# EAGLE design MOSFET_Power_Switch (EAGLE 9.6.2)
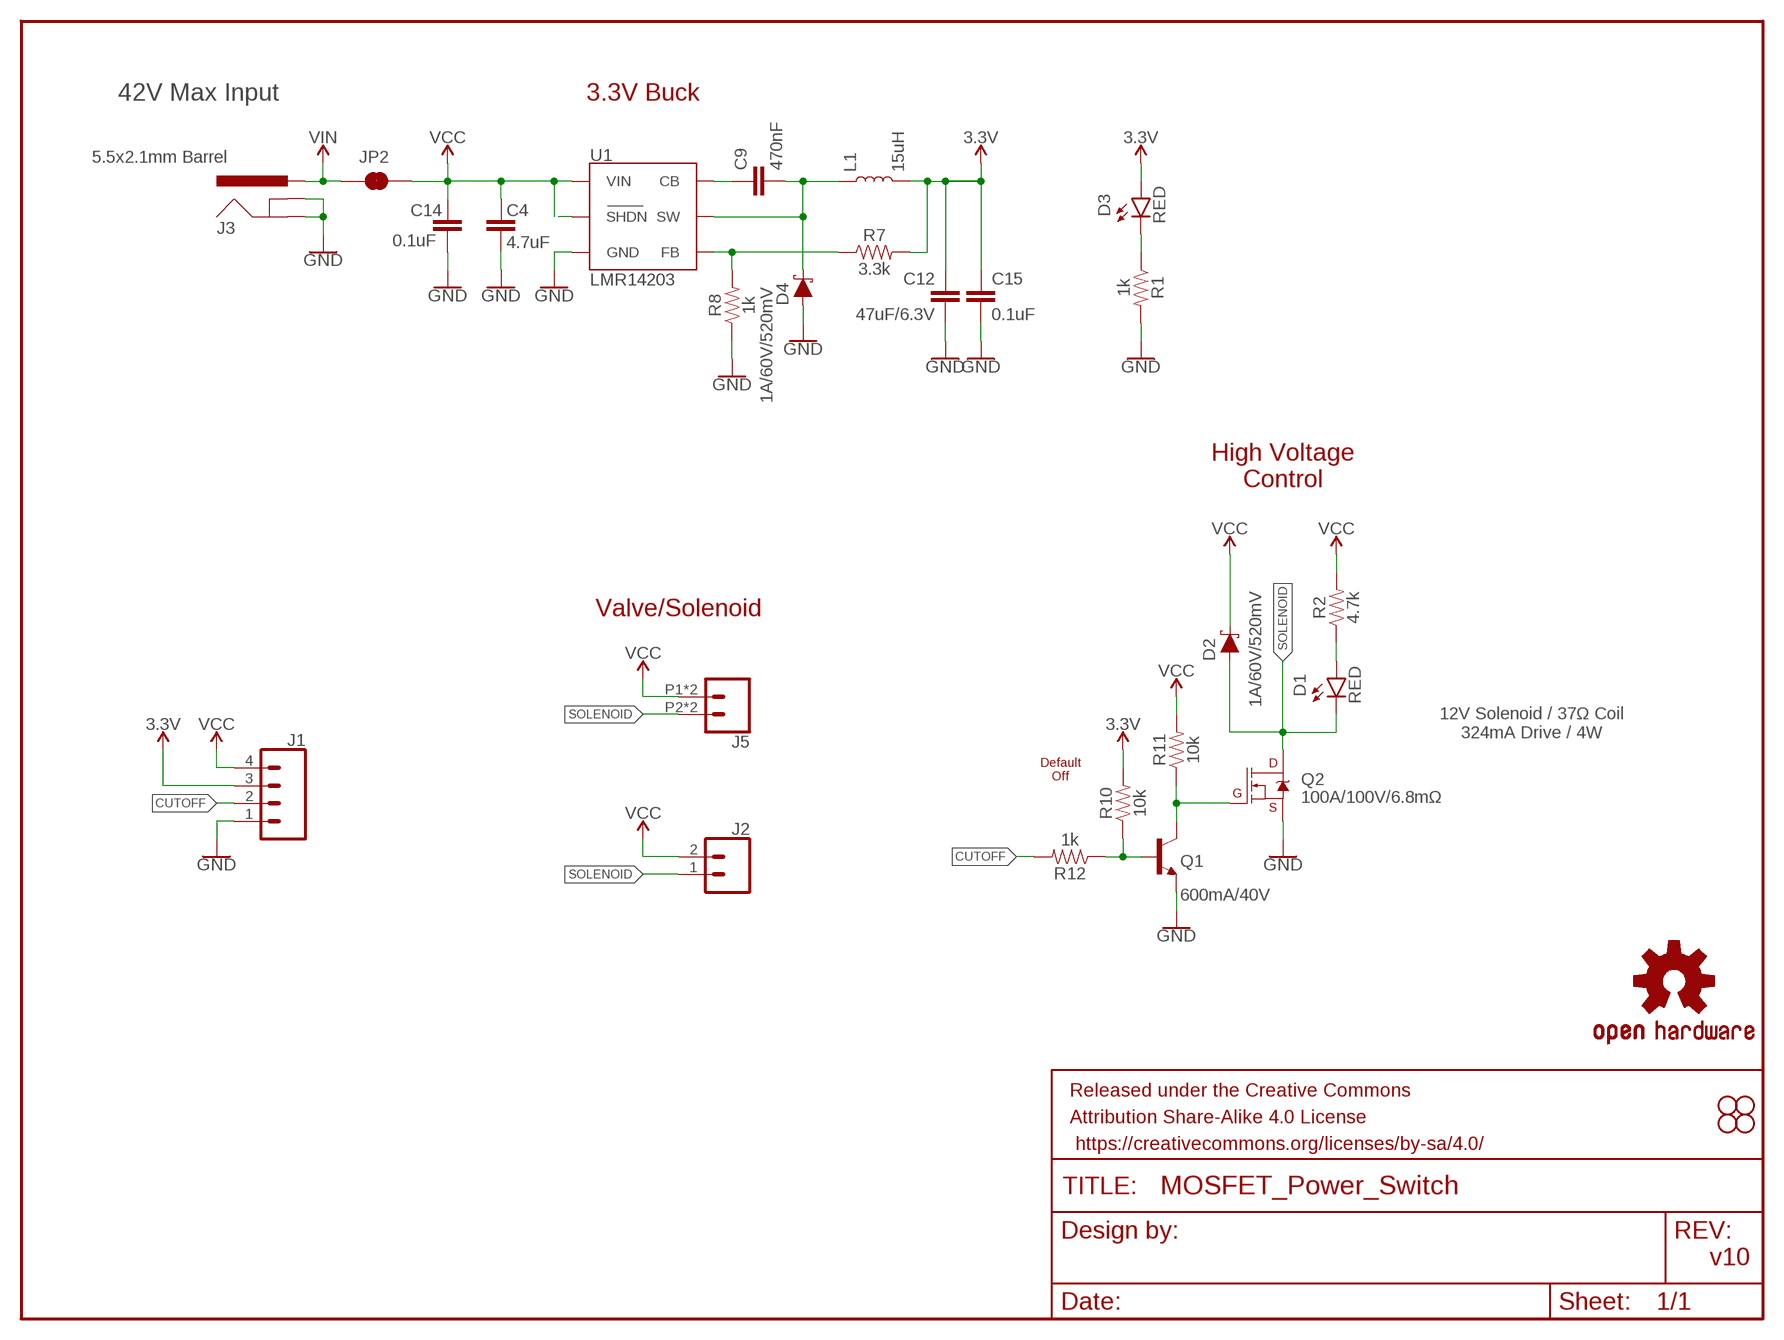
[diagram p0: schematic, sheet 1]

## Parts
C4  4.7uF  4.7UF-0603-35V-(20%)  [0603]
C9  470nF  470NF-0603-10V-10%-X5R  [0603]
C12  47uF/6.3V  47UF  [0805]
C14  0.1uF  0.1UF-0603-100V-10%  [0603]
C15  0.1uF  0.1UF-0603-25V-(+80/-20%)  [0603]
D1  RED  LED-RED0603  [LED-0603]
D2  1A/60V/520mV  DIODE-SCHOTTKY-MSS1P6-M3/89A  [DIODE-MICRO-SMP]
D3  RED  LED-RED0603  [LED-0603]
D4  1A/60V/520mV  DIODE-SCHOTTKY-MSS1P6-M3/89A  [DIODE-MICRO-SMP]
FRAME2  FRAME-LETTER  [CREATIVE_COMMONS]
H1  STAND-OFF  [STAND-OFF]
H2  STAND-OFF  [STAND-OFF]
H3  STAND-OFF  [STAND-OFF]
H4  STAND-OFF  [STAND-OFF]
J1  CONN_041X04_NO_SILK_NO_POP  [1X04_NO_SILK]
J2  CONN_021X02_NO_SILK  [1X02_NO_SILK]
J3  5.5x2.1mm Barrel  POWER_JACKSMD  [POWER_JACK_SMD]
J5  CONN_02SMALL_POKEHOME  [1X02_POKEHOME]
JP2  JUMPER-COMBO_2_NC_TRACE  [COMBO-JUMPER_2_NC_TRACE]
L1  15uH  INDUCTOR-LHQ32-15UH  [INDUCTOR_LQH32]
LOGO1  OSHW-LOGOS  [OSHW-LOGO-S]
Q1  600mA/40V  TRANS_NPN-MMBT2222AL  [SOT23-3]
Q2  100A/100V/6.8mΩ  MOSFET-NCH-PSMN7R0  [TO-263/D2PAK]
R1  1k  1KOHM-0603-1/10W-1%  [0603]
R2  4.7k  4.7KOHM-0603-1/10W-1%  [0603]
R7  3.3k  3.3KOHM-0603-1/10W-1%  [0603]
R8  1k  1KOHM-0603-1/10W-1%  [0603]
R10  10k  10KOHM-0603-1/10W-1%  [0603]
R11  10k  10KOHM-0603-1/10W-1%  [0603]
R12  1k  1KOHM-0603-1/10W-1%  [0603]
U1  LMR14203  [SOT23-6]

## Nets
3.3V: C12.1 C15.1 D3.A J1.3 L1.P$2 R7.2 R10.2
CUTOFF: J1.2 R12.2
GND [power]: C4.2 C12.2 C14.2 C15.2 D4.A J1.1 J3.GND(GNDBREAK) J3.P$4(GND) Q1.2(E) Q2.3(S) R1.2 R8.1 U1.2(GND)
N$1: Q1.3(C) Q2.1(G) R11.1
N$2: D1.A R2.1
N$3: D3.C R1.1
N$5: R7.1 R8.2 U1.3(FB)
N$10: C9.1 U1.1(CB)
N$12: Q1.1(B) R10.1 R12.1
SOLENOID: D1.C D2.A J2.1 J5.P2 J5.P4 Q2.2(D)
VCC: C4.1 C14.1 D2.C J1.4 J2.2 J5.P1 J5.P3 JP2.2 JP2.4 R2.2 R11.2 U1.4(SHDN) U1.5(VIN)
VIN: J3.VIN0(PWR) JP2.1 JP2.3
VSW: C9.2 D4.C L1.P$1 U1.6(SW)

## Notes on the sheet
- 42V Max Input | 3.3V Buck
- High Voltage
  Control
- Valve/Solenoid
- 12V Solenoid / 37Ω Coil
  324mA Drive / 4W
- Default
  Off
- v10

## Library data of the parts
C4 = SparkFun-Capacitors:4.7UF: 4.7µF ceramic capacitors A capacitor is a passive two-terminal electrical component used to store electrical energy temporarily in an electric field.; PROD_ID: CAP-14106
C9 = SparkFun-Capacitors:470NF: 0.47uF/470nF ceramic capacitors A capacitor is a passive two-terminal electrical component used to store electrical energy temporarily in an electric field.; PROD_ID: CAP-13216
C12 = SparkFun-Capacitors:47UF; PROD_ID: CAP-13854
C14 = SparkFun-Capacitors:0.1UF: 0.1µF ceramic capacitors A capacitor is a passive two-terminal electrical component used to store electrical energy temporarily in an electric field.; PROD_ID: CAP-08390
C15 = SparkFun-Capacitors:0.1UF: 0.1µF ceramic capacitors A capacitor is a passive two-terminal electrical component used to store electrical energy temporarily in an electric field.; PROD_ID: CAP-00810
D1 D3 = SparkFun-LED:LED-RED: Red SMD LED Used in manufacturing of most products at SparkFun Packages: 0603 - SMD 0603 package [Product Link] <http://docs.avagotech.com/docs/AV02-0551EN> 0603 SMART - SMD 0603 SMART package ( more efficient and expensive)[Product Link] <http://www.osram-os.com/Graphics/XPic2/00077099_0.pdf> 1206 - SMD1206 package [Product Link] <https://www.sparkfun.com/datasheets/DevTools/LilyPad/Q150OVS4.pdff> SparkFun Products: Pro Mini 328 -5V <https://www.sparkfun.com/products/821> RedBoard <https://www.sparkfun.com/products/12757> IOIO-OTG <https://www.sparkfun.com/products/13613>; PROD_ID: DIO-00819
D2 D4 = SparkFun-DiscreteSemi:DIODE-SCHOTTKY: Schottky diode A Schottky diode is a semiconductor diode which has a low forward voltage drop and a very fast switching action.; PROD_ID: DIO-13919
FRAME2 = SparkFun-Aesthetics:FRAME-LETTER: Schematic Frame - Letter Standard 8.5x11 US Letter frame
H1-H4 = SparkFun-Hardware:STAND-OFF: Stand Off Drill holes for mechanically mounting via screws, standoffs, etc. Note: Use the keepout ring to avoid running the screw head into surrounding components. Variant Overviews STAND-OFF - Mechanical footprint for a #4 phillips button head screw. STAND-OFF-TIGHT - Mechanical footprint for a #4 phillips button head screw, Example SparkFun Products Screw - Phillips Head (1/4", 4-40, 10 pack) <https://www.sparkfun.com/products/10453> (PRT-10453) Screw - Phillips Head (1/2", 4-40, 10 pack) <https://www.sparkfun.com/products/10452> (PRT-10452) Screw - Phillips Head (3/4", 4-40, 10 pack) <https://www.sparkfun.com/products/10451> (PRT-10451) Screw - Phillips Head (1", 4-40, 10 pack) <https://www.sparkfun.com/products/10450> (PRT-10450)
J1 = SparkFun-Connectors:CONN_04: Multi connection point. Often used as Generic Header-pin footprint for 0.1 inch spaced/style header connections On any of the 0.1 inch spaced packages, you can populate with these: Break Away Headers - Straight <https://www.sparkfun.com/products/116> (PRT-00116) Break Away Male Headers - Right Angle <https://www.sparkfun.com/products/553> (PRT-00553) Female Headers <https://www.sparkfun.com/products/115> (PRT-00115) Break Away Headers - Machine Pin <https://www.sparkfun.com/products/117> (PRT-00117) Break Away Female Headers - Swiss Machine Pin <https://www.sparkfun.com/products/743> (PRT-00743) For SCREWTERMINALS and SPRING TERMINALS visit here: Screw Terimnals on SparkFun.com <https://www.sparkfun.com/search/results?term=Screw+Terminals> (5mm/3.5mm/2.54mm spacing) This device is also useful as a general connection point to wire up your design to another part of your project. Our various solder wires solder well into these plated through hole pads. Hook-Up Wire - Assortment (Stranded, 22 AWG) <https://www.sparkfun.com/products/11375> (PRT-11375) Hook-Up Wire - Assortment (Solid Core, 22 AWG) <https://www.sparkfun.com/products/11367> (PRT-11367) View the entire wire category on our website here <https://www.sparkfun.com/categories/141> Special notes: Molex polarized connector foot print use with SKU : PRT-08231 with associated crimp pins and housings. 1MM SMD Version SKU: PRT-10208
J2 = SparkFun-Connectors:CONN_02: Multi connection point. Often used as Generic Header-pin footprint for 0.1 inch spaced/style header connections On any of the 0.1 inch spaced packages, you can populate with these: Break Away Headers - Straight <https://www.sparkfun.com/products/116> (PRT-00116) Break Away Male Headers - Right Angle <https://www.sparkfun.com/products/553> (PRT-00553) Female Headers <https://www.sparkfun.com/products/115> (PRT-00115) Break Away Headers - Machine Pin <https://www.sparkfun.com/products/117> (PRT-00117) Break Away Female Headers - Swiss Machine Pin <https://www.sparkfun.com/products/743> (PRT-00743) For SCREWTERMINALS and SPRING TERMINALS visit here: Screw Terimnals on SparkFun.com <https://www.sparkfun.com/search/results?term=Screw+Terminals> (5mm/3.5mm/2.54mm spacing) This device is also useful as a general connection point to wire up your design to another part of your project. Our various solder wires solder well into these plated through hole pads. Hook-Up Wire - Assortment (Stranded, 22 AWG) <https://www.sparkfun.com/products/11375> (PRT-11375) Hook-Up Wire - Assortment (Solid Core, 22 AWG) <https://www.sparkfun.com/products/11367> (PRT-11367) View the entire wire category on our website here <https://www.sparkfun.com/categories/141> Special notes: Molex polarized connector foot print use with: PRT-08233 with associated crimp pins and housings. 2.54_SCREWTERM for use with PRT-10571. 3.5mm Screw Terminal footprints for PRT-08084 5mm Screw Terminal footprints for use with PRT-08432
J3 = SparkFun-Connectors:POWER_JACK: Power Jack Connector This is the standard 5.5mm barrel jack for power. The PTH is the most common, proven, reliable, footprint. The Slot footprint only works if the mill layer is transmitted to the PCB fab house so be warned. Here are the connectors we sell at SparkFun: DC Barrel Power Jack/Connector <https://www.sparkfun.com/products/119> (PRT-00119) DC Barrel Power Jack/Connector (SMD) <https://www.sparkfun.com/products/12748> (PRT-12748) DC Barrel Jack Adapter - Breadboard Compatible <https://www.sparkfun.com/products/10811> (PRT-10811) It is used on this SparkFun product (and many, many others): SparkFun RedBoard - Programmed with Arduino <https://www.sparkfun.com/products/12757> (DEV-12757) Also, if you need a mating power supply or connector, please check these out: Wall Adapter Power Supply - 9VDC 650mA <https://www.sparkfun.com/products/298> (TOL-00298) DC Barrel Jack Adapter - Male <https://www.sparkfun.com/products/10287> (PRT-10287); PROD_ID: CONN-08106; SF_ID: PRT-12748
J5 = SparkFun-Connectors:CONN_02: Multi connection point. Often used as Generic Header-pin footprint for 0.1 inch spaced/style header connections On any of the 0.1 inch spaced packages, you can populate with these: Break Away Headers - Straight <https://www.sparkfun.com/products/116> (PRT-00116) Break Away Male Headers - Right Angle <https://www.sparkfun.com/products/553> (PRT-00553) Female Headers <https://www.sparkfun.com/products/115> (PRT-00115) Break Away Headers - Machine Pin <https://www.sparkfun.com/products/117> (PRT-00117) Break Away Female Headers - Swiss Machine Pin <https://www.sparkfun.com/products/743> (PRT-00743) For SCREWTERMINALS and SPRING TERMINALS visit here: Screw Terimnals on SparkFun.com <https://www.sparkfun.com/search/results?term=Screw+Terminals> (5mm/3.5mm/2.54mm spacing) This device is also useful as a general connection point to wire up your design to another part of your project. Our various solder wires solder well into these plated through hole pads. Hook-Up Wire - Assortment (Stranded, 22 AWG) <https://www.sparkfun.com/products/11375> (PRT-11375) Hook-Up Wire - Assortment (Solid Core, 22 AWG) <https://www.sparkfun.com/products/11367> (PRT-11367) View the entire wire category on our website here <https://www.sparkfun.com/categories/141> Special notes: Molex polarized connector foot print use with: PRT-08233 with associated crimp pins and housings. 2.54_SCREWTERM for use with PRT-10571. 3.5mm Screw Terminal footprints for PRT-08084 5mm Screw Terminal footprints for use with PRT-08432; PROD_ID: CONN-13512
JP2 = SparkFun-Jumpers:JUMPER-COMBO_2_NC_TRACE
L1 = SparkFun-Coils:INDUCTOR: Inductors Resist changes in electrical current. Basically a coil of wire. SparkFun Products: SparkFun Load Cell Amplifier - HX711 <https://www.sparkfun.com/products/13879> IOIO-OTG - V2.2 <https://www.sparkfun.com/products/13613>; PROD_ID: NDUC-14107
LOGO1 = SparkFun-Aesthetics:OSHW-LOGO: Open-Source Hardware (OSHW) Logo This logo indicates the piece of hardware it is found on incorporates a OSHW license and/or adheres to the definition of open source hardware found here: http://freedomdefined.org/OSHW
Q1 = SparkFun-DiscreteSemi:TRANS_NPN: NPN transistor Current controlled devices typically used to amplify current or used as a switch. BC547 - COM-08928 <http://www.sparkfun.com/products/8928> (TO-92 45V 100mA) (1.Collector 2.Base 3.Emitter) 2N3904 - COM-00521 <http://www.sparkfun.com/products/521> (TO-92 40V 200mA) (1.Emitter 2.Base 3.Collector) P2N2222A - COM-12852 <http://www.sparkfun.com/products/12852> (TO-92 40V 600mA) (1.Collector 2.Base 3.Emitter); PROD_ID: TRANS-08049
Q2 = SparkFun-DiscreteSemi:MOSFET-NCH: N-channel MOSFETs Voltage controlled devices that allow control of high current outputs. SparkFun Products: SparkFun OpenScale <https://www.sparkfun.com/products/13261> SparkFun Digital Sandbox <https://www.sparkfun.com/products/12651> SparkFun Monster Moto Shield <https://www.sparkfun.com/products/10182> SparkFun MOSFET Power Controller <https://www.sparkfun.com/products/11214>; PROD_ID: TRANS-12437
R1 R8 R12 = SparkFun-Resistors:1KOHM: 1kΩ resistor A resistor is a passive two-terminal electrical component that implements electrical resistance as a circuit element. Resistors act to reduce current flow, and, at the same time, act to lower voltage levels within circuits. - Wikipedia; PROD_ID: RES-07856
R2 = SparkFun-Resistors:4.7KOHM: 4.7kΩ resistor A resistor is a passive two-terminal electrical component that implements electrical resistance as a circuit element. Resistors act to reduce current flow, and, at the same time, act to lower voltage levels within circuits. - Wikipedia; PROD_ID: RES-07857
R7 = SparkFun-Resistors:3.3KOHM: 3.3kΩ resistor A resistor is a passive two-terminal electrical component that implements electrical resistance as a circuit element. Resistors act to reduce current flow, and, at the same time, act to lower voltage levels within circuits. - Wikipedia; PROD_ID: RES-07851
R10 R11 = SparkFun-Resistors:10KOHM: 10kΩ resistor A resistor is a passive two-terminal electrical component that implements electrical resistance as a circuit element. Resistors act to reduce current flow, and, at the same time, act to lower voltage levels within circuits. - Wikipedia; PROD_ID: RES-00824
U1 = SparkFun-IC-Power:LMR14203; PROD_ID: IC-13918

## Net classes
1 power: width 0.254 mm

## Board
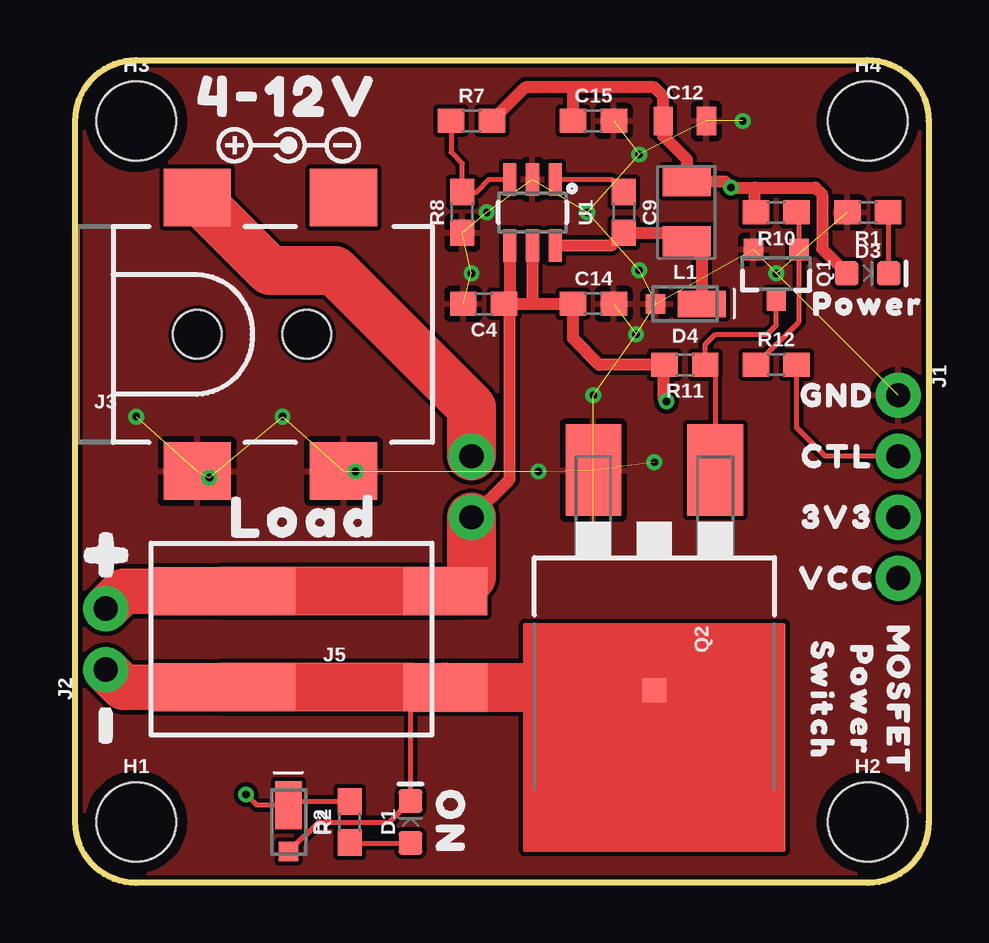
[diagram p1: board, top side]
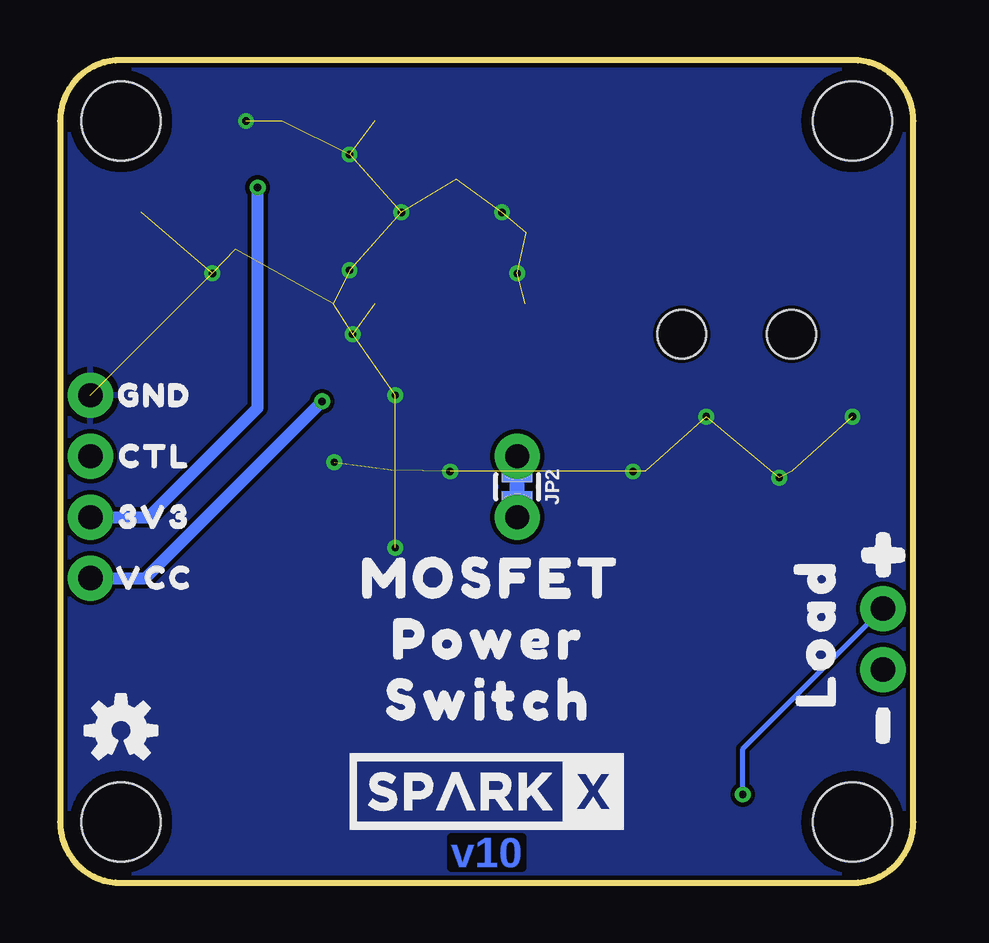
[diagram p2: board, bottom side, seen from below]

Size 35.56 x 34.29 mm. Coordinates in mm from the lower left corner, seen from the top.
Outline: 0,2.54 0,31.75 arc-90 2.54,34.29 33.02,34.29 arc-90 35.56,31.75 35.56,2.54 arc-90 33.02,0 2.54,0 arc-90 0,2.54
Copper layers (1*16): Top 0.035mm / dielectric 1.5mm / Bottom 0.035mm
Design rules "SparkFun-2-Layer-General-JLCPCB": minimum track width 7mil, minimum drill 0.3mm, track to track 7mil, track to pad 7mil, pad to pad 7mil, via to via 7mil, smd to smd 7mil, copper to edge 7mil, drill to drill 7mil, minimum pad ring 7mil, minimum via ring 7mil, stop-mask expansion 3mil, vias tented up to drill 25mil, thermal gap 10mil

### Footprints (pad centres in the part's own frame; a part is rotated, then mirrored left to right if it is on the bottom)
0603 = smd 1.1 x 1: 1 -0.85,0; 2 0.85,0
0805 = smd 0.8 x 1.2: 1 -0.9,0; 2 0.9,0
LED-0603 = smd 1 x 1: A -0.877,0; C 0.877,0
DIODE-MICRO-SMP = smd 0.813 x 0.813: A 1.219,0 | smd 2.007 x 1.102: C -0.699,0
STAND-OFF = hole 3.302: 0,0
1X04_NO_SILK = drill 1.016 pad 1.88: 1 0,0; 2 2.54,0; 3 5.08,0; 4 7.62,0
1X02_NO_SILK = drill 1.016 pad 1.88: 1 0,0; 2 2.54,0
POWER_JACK_SMD = smd 2.8 x 2.4: GND 0,-5.7; P$4 6.1,-5.7; VIN0 0,5.7; VIN1 6.1,5.7 | hole 2.032: 0,0; 4.572,0
1X02_POKEHOME = smd 3.5 x 2: P1 5.25,2; P2 5.25,-2 | smd 6 x 2: P3 -4,2; P4 -4,-2
COMBO-JUMPER_2_NC_TRACE = smd 0.635 x 1.27: 1 -0.508,0; 2 0.508,0 | drill 1.016 pad 1.88: 3 -1.27,0; 4 1.27,0
INDUCTOR_LQH32 = smd 2 x 1.25: P$1 -0.07,1.205; P$2 -0.07,-1.295
SOT23-3 = smd 0.8 x 0.9: 1 -0.95,-1; 2 0.95,-1; 3 0,1.1
TO-263/D2PAK = smd 2.32 x 3.81: 1 -2.54,-7.045; 3 2.54,-7.045 | smd 1 x 1: 2 0,2.125
SOT23-6 = smd 0.55 x 1.35: 1 -0.95,-1.375; 2 0,-1.375; 3 0.95,-1.375; 4 0.95,1.375; 5 0,1.375; 6 -0.95,1.375

### Placement (x,y rotation side)
C4  17.02,24.13 180 top
C9  22.86,27.94 270 top
C12  25.4,31.75 0 top
C14  21.59,24.13 0 top
C15  21.59,31.75 0 top
D1  13.97,2.54 90 top
D2  8.89,2.54 270 top
D3  33.02,25.4 0 top
D4  25.4,24.13 180 top
FRAME2  -10.16,-12.7 0 top  (outside the outline)
H1  2.54,2.54 0 top
H2  33.02,2.54 0 top
H3  2.54,31.75 0 top
H4  33.02,31.75 0 top
J1  34.29,20.32 270 top
J2  1.27,8.89 90 top
J3  5.08,22.86 0 top
J5  10.16,10.16 0 top
JP2  16.51,16.51 270 bottom
L1  25.4,27.94 180 top
LOGO1  33.02,6.35 0 bottom
Q1  29.21,25.4 180 top
Q2  24.13,10.16 180 top
R1  33.02,27.94 180 top
R2  11.43,2.54 90 top
R7  16.51,31.75 0 top
R8  16.13,27.94 90 top
R10  29.21,27.94 180 top
R11  25.4,21.59 180 top
R12  29.21,21.59 0 top
U1  19.05,27.94 180 top
U$1  [3V32]  31.75,15.24 0 top
U$2  [MOSFET0]  34.29,7.62 270 top
U$3  [GND0]  31.75,20.32 0 top
U$5  [LOAD0]  9.53,15.24 0 top
U$6  [4#12V0]  8.89,32.77 0 top
U$7  [VCC3]  31.75,12.7 0 top
U$8  [CTL0]  31.75,17.78 0 top
U$9  [POWER1]  32.77,7.62 270 top
U$10  [#0]  1.27,13.46 270 top
U$11  [#1]  1.27,6.35 270 top
U$13  [SWITCH2]  31.11,7.62 270 top
U$15  [GND0]  31.62,20.32 0 bottom
U$16  [CTL0]  31.62,17.78 0 bottom
U$17  [3V32]  31.62,15.24 0 bottom
U$18  [VCC3]  31.62,12.7 0 bottom
U$19  [LOAD0]  4.06,10.41 90 bottom
U$20  [#0]  1.27,13.46 270 bottom
U$21  SPARKX-LOGO5  [SPARKX-LARGE]  17.78,3.81 0 bottom
U$22  [#1]  1.27,6.35 270 bottom
U$23  [POWER0]  33.02,24.13 0 top
U$24  [MOSFET_0]  17.27,12.7 0 bottom
U$25  [POWER_1]  17.4,10.16 0 bottom
U$26  [SWITCH_2]  17.4,7.62 0 bottom
U$29  [POLARITY_MARKING_CENTER_POSITIVE#JPG]  8.89,30.73 180 top
U$49  [ON0]  15.62,2.54 270 top

### Tracks (layer width: path | path; a pad name or v marks a point on that pad's centre or on a via)
3.3V  (via drill 0.3)
  Top 0.508: 20.83,33.15 24.13,33.15 24.5,32.78 C12.1 24.5,31.13 25.47,30.16 L1.P$2 27.07,29.23 v27.32,28.98 28.32,28.98 | 20.83,33.15 18.76,33.15 R7.2 | C15.1 20.74,33.06 20.83,33.15 | 28.32,28.98 30.84,28.98 31.11,28.7 31.11,26.43 D3.A | R10.2 28.32,27.98 28.32,28.98
  Bottom 0.508: J1.3 31.88,15.24 27.32,19.79 v27.32,28.98
CUTOFF
  Top 0.203: J1.2 31.24,17.78 30.06,18.96 R12.2
GND  (via drill 0.3)  (28 unrouted)
  other vias: 5.59,16.89 11.68,17.14 19.3,17.14 21.59,20.32 24.13,17.53 23.37,22.86 23.5,25.53 21.34,27.94 17.14,27.94 23.5,30.35 27.81,31.75 21.59,13.97 16.51,25.4 29.21,25.4 2.54,19.43 8.64,19.43
  pour Top (isolate 0.178, rank 3): 0,34.29 35.56,34.29 35.56,0 0,0
  pour Bottom (isolate 0.178, rank 3): 0,34.29 35.56,34.29 35.56,0 0,0
N$1
  Top 0.203: Q2.1 26.67,21.17 R11.1 26.25,22.44 26.67,22.86 28.83,22.86 29.21,23.24 Q1.3
N$2
  Top 0.203: R2.1 11.46,1.66 D1.A
N$3
  Top 0.203: D3.C 33.9,27.91 R1.1
N$5
  Top 0.203: 15.58,31.67 R7.1 15.66,30.44 16.13,29.97 R8.2 16.73,28.79 17.25,29.32 U1.3
N$10
  Top 0.203: U1.1 22.34,29.32 C9.1
N$12
  Top 0.203: R12.1 30.16,23.39 Q1.1 30.16,27.84 R10.1
SOLENOID
  Top 0.203: 13.97,8.16 D1.C 13.09,2.54 10.14,2.54 9.56,1.96 9.53,1.96 D2.A
  Top 1.905: J5.P4 2,8.16 J2.1
  Top 2.032: J5.P4 13.97,8.16 J5.P2 24,8.16 Q2.2
VCC  (via drill 0.3)
  Top 0.203: R2.2 9.04,3.39 D2.C 7.56,3.24 v7.11,3.68
  Top 0.508: U1.4 18.1,24.13 | 18.1,24.13 18.1,16.83 JP2.4 | C4.1 18.1,24.13 | 18.1,24.13 19.05,24.13 | 19.05,24.13 C14.1 20.74,22.69 21.84,21.59 24.51,21.59 | U1.5 19.05,24.13 | R11.2 24.51,21.59 | v24.64,20.07 24.51,20.19 24.51,21.59
  Top 1.905: J5.P3 2,12.16 J2.2
  Top 2.032: J5.P3 J5.P1 15.92,12.16 16.51,12.75 JP2.4
  Bottom 0.203: v7.11,3.68 7.11,5.59 J2.2
  Bottom 0.508: J1.4 32,12.7 v24.64,20.07 | JP2.2 JP2.4
VIN
  Top 2.032: 5.08,28.45 J3.VIN0 8.11,25.53 10.79,25.53 16.51,19.81 JP2.3
  Bottom 0.508: JP2.1 JP2.3
VSW
  Top 0.508: U1.6 22.34,26.57 C9.2 25.11,27.09 L1.P$1 26.1,26.11 D4.C

### Text on the board
Bottom: v10